# Altium schematic sheet class_D_amplifier.SchDoc
size A4; SheetNumber: 1; SheetTotal: 2; SPICEModelCacheECQTYCTI: <root> / <DocumentId>ECQTYCTI</DocumentId> / <CacheFrame Number="0"> / <Model Name="pnp" Kind="MDL"> / <Text>*Default PNP BJT / *PNP Trans Pinout: C,B,E / .MODEL PNP PNP()</Text> / </Model> / <Model Name="qnpn" Kind="MDL"> / <Text>*QNPN / *NPN Trans Pinout: C,B,E / .MODEL QNPN NPN(IS=3.2E-16 BF=141 VAF=35 ISE=2.6 NE=1.46 CJE=1E-13 / + MJE=0.333 TF=6E-11 CJC=1E-13 CJS=2.2E-13 MJS=0.5 FC=0.67 )</Text> / </Model> / </CacheFrame> / </root>
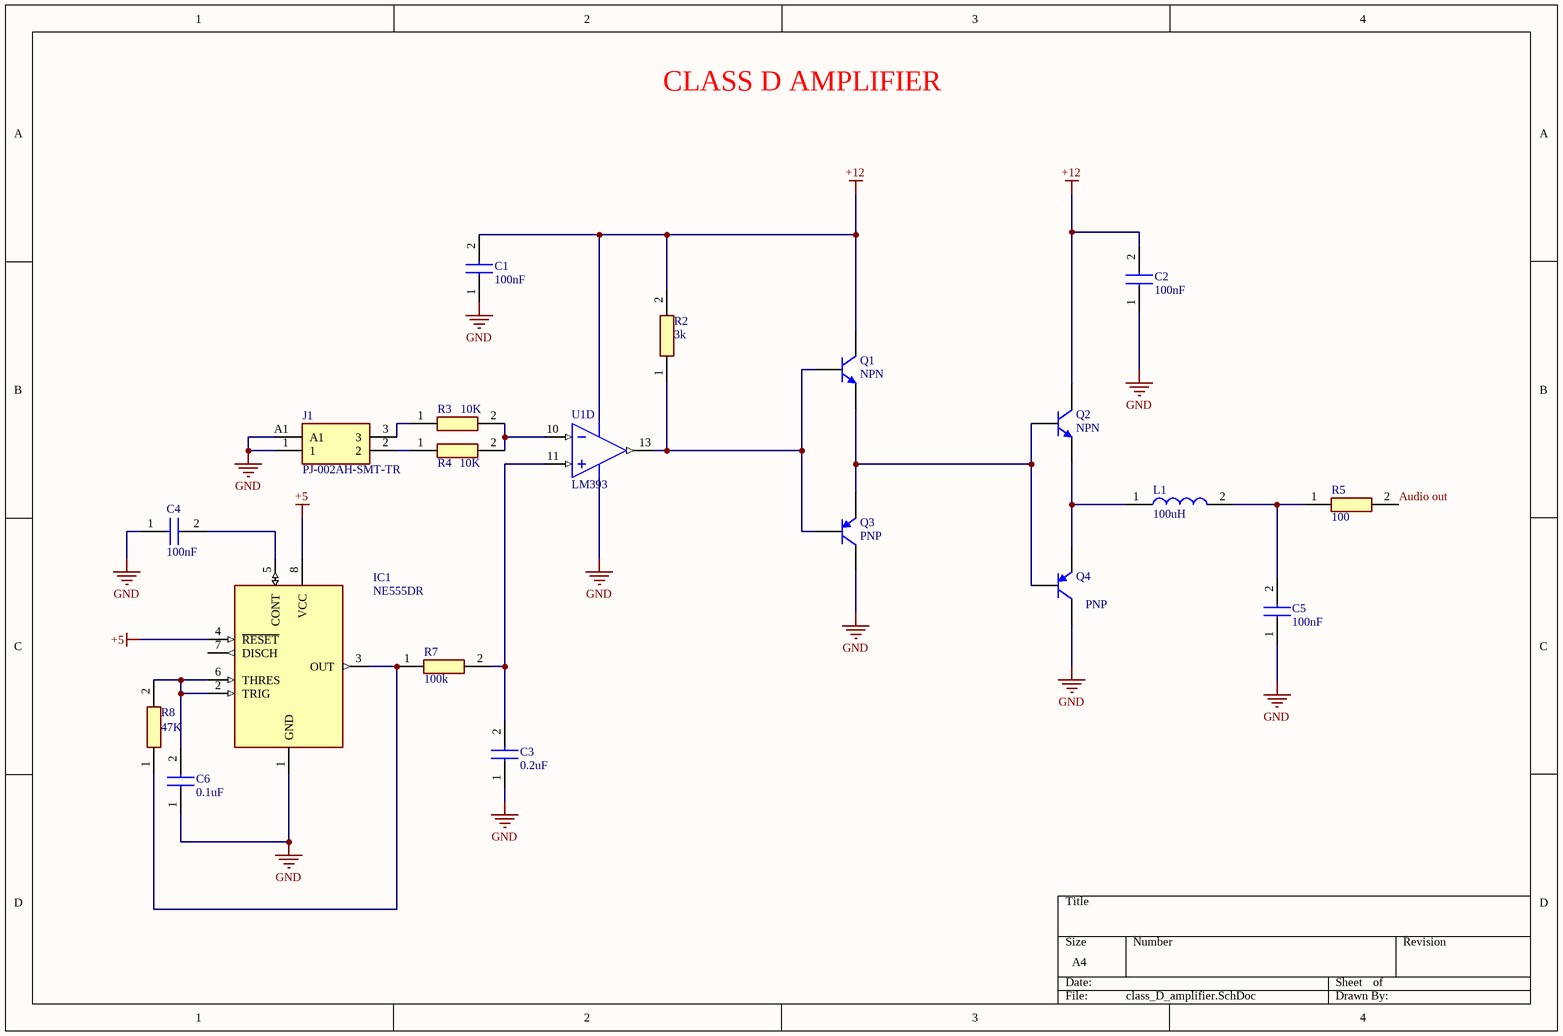
[diagram p0: class_D_amplifier.SchDoc]

## Parts
C1  100nF  [CAPC1608X90N]
C2  100nF  [CAPC1608X90N]
C3  0.2uF  [CAPC1608X90N]
C4  100nF  [CAPC1608X90N]
C5  100nF  [CAPC1608X90N]
C6  0.1uF  [CAPC1608X90N]
IC1  NE555DR  [SOIC127P600X175-8N]
J1  PJ-002AH-SMT-TR  [PJ002AHSMTTR]
L1  100uH  [IFDC3030EZER101M]
Q1  NPN  [SOT-23B_L]
Q2  NPN  [SOT-23B_L]
Q3  PNP  [SOT-23B_L]
Q4  PNP  [SOT-23B_L]
R2  3k  [ERA3AEB101V]
R3  10K  [ERA3AEB101V]
R4  10K  [ERA3AEB101V]
R5  100  [ERA3AEB101V]
R7  100k  [ERA3AEB101V]
R8  47K  [ERA3AEB101V]
U1  LM393  [SOP65P640X120-8N]  (part D of 4)

## Nets
+5: IC1.4(~{RESET}) IC1.8(VCC)
+12: C1.2 C2.2 Q1.1(C) Q2.1(C) R2.2
GND: C1.1 C2.1 C3.1 C4.1 C5.1 C6.1 IC1.1(GND) J1.1 J1.A1 Q3.1(C) Q4.1(C)
Audio out: R5.2
NetC3_2: C3.2 R7.2 U1.11(IN4+)
NetC4_2: C4.2 IC1.5(CONT)
NetC5_2: C5.2 L1.2 R5.1
NetC6_2: C6.2 IC1.2(TRIG) IC1.6(THRES) R8.2
NetIC1_3: IC1.3(OUT) R7.1 R8.1
NetJ1_2: J1.2 R4.1
NetJ1_3: J1.3 R3.1
NetL1_1: L1.1 Q2.3(E) Q4.3(E)
NetQ1_2: Q1.2(B) Q3.2(B) R2.1 U1.13(OUT4)
NetQ1_3: Q1.3(E) Q2.2(B) Q3.3(E) Q4.2(B)
NetR3_2: R3.2 R4.2 U1.10(IN4-)

Not connected (* = marked no-connect by the designer): IC1 7(DISCH)

## Notes on the sheet
- CLASS D AMPLIFIER

## Library data of the parts
C1-C6 = GRM188R71C104MA01D: Capacitor; Manufacturer_Name: Murata Electronics; Datasheet Link: http://componentsearchengine.com/Datasheets/1/GRM188R71C104MA01D.pdf; Height: 0.9mm; Manufacturer_Part_Number: GRM188R71C104MA01D; Mouser Part Number: 81-GRM18R71C104MA01D; Mouser Price/Stock: https://www.mouser.com/Search/Refine.aspx?Keyword=81-GRM18R71C104MA01D; Arrow Part Number: GRM188R71C104MA01D; Arrow Price/Stock: https://www.arrow.com/en/products/grm188r71c104ma01d/murata-manufacturing
IC1 = NE555DR: Integrated Circuit; Manufacturer_Name: Texas Instruments; Datasheet Link: http://www.ti.com/lit/ds/symlink/ne555.pdf; Height: 1.75mm; Manufacturer_Part_Number: NE555DR; Mouser Part Number: 595-NE555DR; Mouser Price/Stock: https://www.mouser.com/Search/Refine.aspx?Keyword=595-NE555DR; RS Part Number: 1218414; RS Price/Stock: http://uk.rs-online.com/web/p/products/1218414
J1 = PJ-002AH-SMT-TR: Connector; Manufacturer_Name: Same Sky; Datasheet Link: https://www.sameskydevices.com/product/resource/supplyframepdf/pj-002ah-smt-tr.pdf; Height: 11.1mm; Manufacturer_Part_Number: PJ-002AH-SMT-TR; Mouser Part Number: 490-PJ-002AH-SMT-TR; Mouser Price/Stock: https://www.mouser.co.uk/ProductDetail/Same-Sky/PJ-002AH-SMT-TR?qs=WyjlAZoYn52i5LSWfoFS9w%3D%3D; Arrow Part Number: PJ-002AH-SMT-TR; Arrow Price/Stock: https://www.arrow.com/en/products/pj-002ah-smt-tr/cui-devices?utm_currency=USD&region=europe
L1 = IFDC3030EZER101M: Inductor; Manufacturer_Name: Vishay; Datasheet Link: https://www.vishay.com/docs/34634/ifdc3030ez.pdf; Height: 5mm; Manufacturer_Part_Number: IFDC3030EZER101M; Mouser Part Number: 70-IFDC3030EZER101M; Mouser Price/Stock: https://www.mouser.co.uk/ProductDetail/Vishay-Dale/IFDC3030EZER101M?qs=iLKYxzqNS76MdVQy6oVcaA%3D%3D
Q1 Q2 = QNPN: NPN Bipolar Transistor; Published: 8-Jun-2000; LatestRevisionDate: 29-May-2009; LatestRevisionNote: IPC-7351 Footprint Added.; PackageVersion: Aug-1999; PackageReference: SOT-23B; Publisher: Altium Limited; PackageDescription: 3-Pin SOT-23 Package 0.95 mm Pitch, 2.4 mm Lead Span
Q3 Q4 = PNP: PNP Bipolar Transistor; Published: 8-Jun-2000; LatestRevisionDate: 29-May-2009; LatestRevisionNote: IPC-7351 Footprint Added.; PackageVersion: Aug-1999; PackageReference: SOT-23B; Publisher: Altium Limited; PackageDescription: 3-Pin SOT-23 Package 0.95 mm Pitch, 2.4 mm Lead Span
R2-R5 R7 R8 = ERA-3AED102V: Resistor; Manufacturer_Name: Panasonic; Datasheet Link: https://industrial.panasonic.com/cdbs/www-data/pdf/RDM0000/AOA0000C307.pdf; Height: 0.55mm; Manufacturer_Part_Number: ERA-3AED102V; Mouser Part Number: 667-ERA-3AED102V; Mouser Price/Stock: https://www.mouser.co.uk/ProductDetail/Panasonic/ERA-3AED102V?qs=yocZuyCaXdNrh6oeFjCchg%3D%3D; Arrow Part Number: ERA-3AED102V; Arrow Price/Stock: https://www.arrow.com/en/products/era3aed102v/panasonic?region=nac
U1 = IC_LM339M/NOPB: Comparator General Purpose CMOS, DTL, ECL, MOS, Open-Collector, TTL 14-SOIC; Manufacturer: TI National Semiconductor; Alternate Part Number-1: NA; Manufacturer Part Number: LM339M/NOPB; Case/Package: SOIC14; Supplier-1: RS COMP; Supplier Part Number-1: LM339M/NOPB